# EAGLE design BMI160 SCHEMATIC (EAGLE 9.6.2)
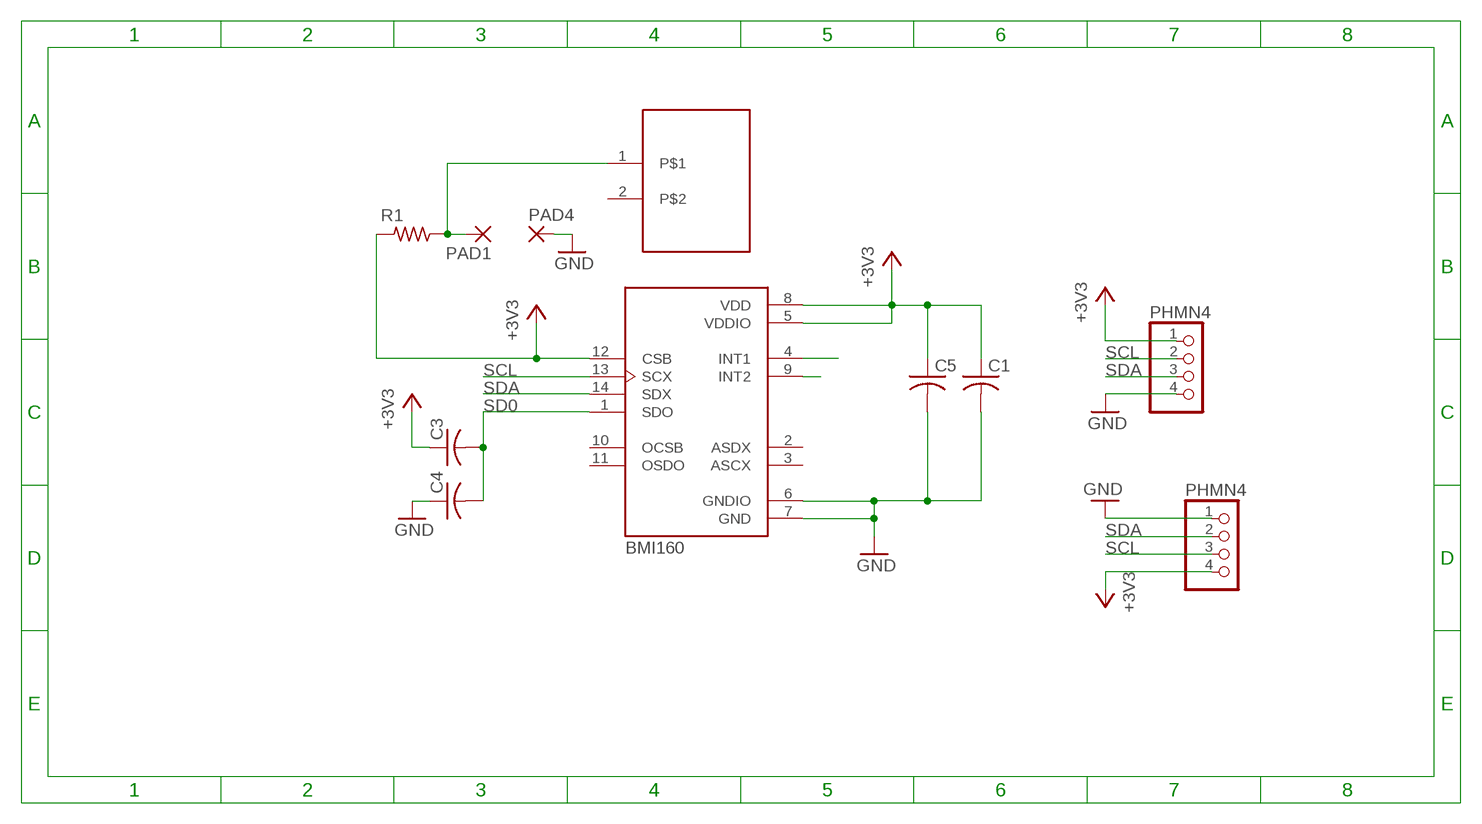
[diagram p0: schematic, sheet 1]

## Parts
C1  C-USC0805  [C0805]
C3  C-USC0805  [C0805]
C4  C-USC0805  [C0805]
C5  C-USC0805  [C0805]
PAD1  WIREPADSMD1,27-254  [SMD1,27-2,54]
PAD4  WIREPADSMD1,27-254  [SMD1,27-2,54]
R1  CRCW08050000Z0EA  [RES_0805]
U1  BMI160  [PQFN50P300X250X88-14N]
U$1  PHMN4  [1X04]
U$2  PHMN4  [1X04]
U$3  PHMN4-21X02  [HDRV2W64P254_1X2_1016X508X838B]

## Nets
+3.3: C1.1 C3.1 C5.1 R1.2 U1.5(VDDIO) U1.8(VDD) U1.12(CSB) U$1.1 U$2.4 ; supply symbol labelled +3V3
GND: C1.2 C4.1 C5.2 PAD4.1(P) U1.6(GNDIO) U1.7(GND) U$1.4 U$2.1
N$1: U1.9(INT2)
N$2: PAD1.1(P) R1.1 U$3.1
N$5: U1.4(INT1)
SCL: U1.13(SCX) U$1.2 U$2.3
SD0: C3.2 C4.2 U1.1(SDO)
SDA: U1.14(SDX) U$1.3 U$2.2
Unconnected: U1.2(ASDX) U1.3(ASCX) U1.10(OCSB) U1.11(OSDO) U$3.2

## Library data of the parts
C1 C3-C5 = rcl:C-US: CAPACITOR, American symbol; SPICEPREFIX: C
PAD1 PAD4 = wirepad:WIREPAD: Wire PAD connect wire on PCB
R1 = Resistor_Capacitor:CRCW08050000Z0EA: RES SMD 0 OHM JUMPER 1/8W 0805 Manufacturer's datasheet <http://www.vishay.com/docs/20035/dcrcwe3.pdf>; CREATED_BY: PCBLayout.com; DIGIKEY_PART_NUMBER: 541-0.0ATR-ND; MANUFACTURER: Vishay Dale; MPN: CRCW08050000Z0EA; PACKAGE: SMD 0805
U1 = BMI160:BMI160: BMI160 2.5 x 3 mm Tiaxial Accelerometer / Gyroscope Inertial Measurement Unit Check prices <https://pricing.snapeda.com/parts/BMI160/Bosch/view-part?ref=eda>; AVAILABILITY: Warning; DESCRIPTION: Accelerometer, Gyroscope, 6 Axis Sensor I²C, SPI Output; MF: Bosch; MP: BMI160; PACKAGE: LGA-14 Bosch; PRICE: None; PURCHASE-URL: https://pricing.snapeda.com/search/part/BMI160/?ref=eda
U$1 U$2 = USER:PHMN4
U$3 = USER:PHMN4-2

## Net classes
0 default: clearance 0.205 mm

## Board
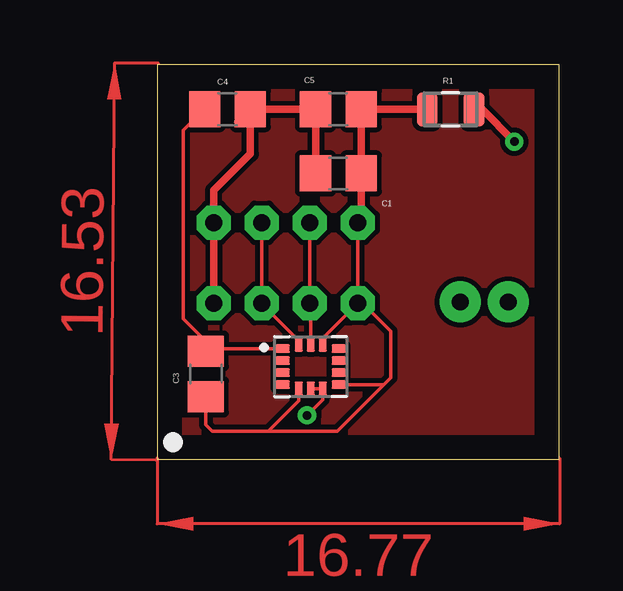
[diagram p1: board, top side]
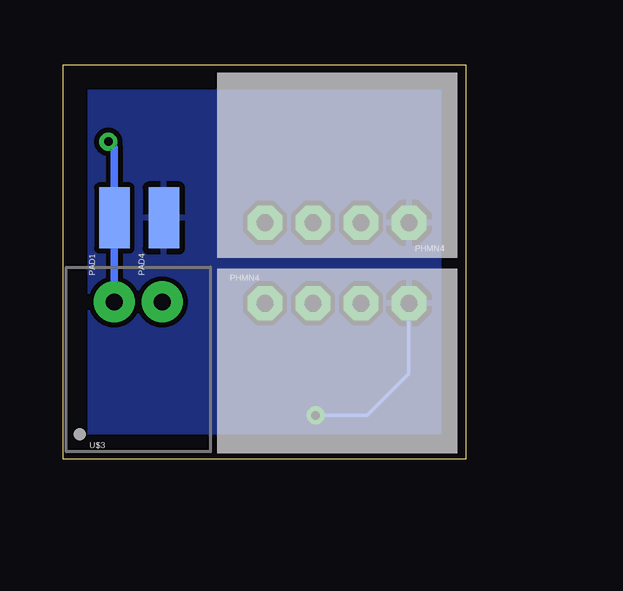
[diagram p2: board, bottom side, seen from below]

Size 16.76 x 16.43 mm. Coordinates in mm from the lower left corner, seen from the top.
Outline: 0,0 16.76,0 16.76,16.43 0,16.43 0,0
Copper layers (1*16): Top 0.035mm / dielectric 1.5mm / Bottom 0.035mm
Design rules "default *": minimum track width 6mil, minimum drill 0.35mm, track to track 6mil, track to pad 6mil, pad to pad 0.2mm, via to via 6mil, smd to smd 6mil, copper to edge 40mil, drill to drill 6mil, minimum pad ring 10mil, minimum via ring 8mil, stop-mask expansion 4mil, vias tented up to drill 0mil, thermal gap 10mil

### Footprints (pad centres in the part's own frame; a part is rotated, then mirrored left to right if it is on the bottom)
C0805 = smd 1.3 x 1.5: 1 -0.95,0; 2 0.95,0
SMD1,27-2,54 = smd 1.27 x 2.54: 1 0,0
RES_0805 = smd 0.87 x 1.42: 1 -0.975,0; 2 0.975,0
PQFN50P300X250X88-14N = smd 0.59 x 0.35: 1 -1.165,0.75; 2 -1.165,0.25; 3 -1.165,-0.25; 4 -1.165,-0.75; 8 1.165,-0.75; 9 1.165,-0.25; 10 1.165,0.25; 11 1.165,0.75 | smd 0.35 x 0.59: 5 -0.5,-0.915; 6 0,-0.915; 7 0.5,-0.915; 12 0.5,0.915; 13 0,0.915; 14 -0.5,0.915
1X04 = drill 0.7 pad 1.422 octagon: 1 -3.08,3.71; 2 -1.08,3.71; 3 0.92,3.71; 4 2.92,3.71
HDRV2W64P254_1X2_1016X508X838B = drill 0.7 pad 1.705: 1 2,6.25; 2 4,6.25

### Placement (x,y rotation side)
C1  7.55,11.91 180 top
C3  2.03,3.56 90 top
C4  2.94,14.59 180 top
C5  7.55,14.59 180 top
PAD1  14.64,10.06 0 bottom
PAD4  12.58,10.06 0 bottom
R1  12.23,14.58 180 top
U1  6.4,3.86 0 top
U$1  5.28,2.78 0 bottom
U$2  5.44,13.56 180 bottom
U$3  16.64,0.3 0 bottom

### Tracks (layer width: path | path; a pad name or v marks a point on that pad's centre or on a via)
+3.3
  Top 0.152: U1.5 5.9,2.44 4.63,1.17 | C3.1 2.03,1.44 2.3,1.17 4.63,1.17 | 4.63,1.17 7.51,1.17 9.45,3.11 9.44,3.11 | U1.8 9.44,3.11 | 9.44,3.11 9.73,3.41 9.73,5.34 8.57,6.49 U$1.1 | U1.12 6.9,5.04 U$1.1 | U$1.1 8.36,9.72 U$2.4 8.5,10 | 8.5,11.74 C1.1
  Top 0.305: 8.73,11.91 C1.1 8.5,9.86 8.36,9.72 | 8.5,11.74 C5.1 R1.2
GND  (via drill 0.35)
  Top 0.152: U1.6 U1.7 6.9,2.48 v6.25,1.83 | C4.1
  Top 0.305: U$1.4 U$2.1 2.36,11.2 3.89,12.73 C4.1 | C4.1 3.37,14.07 | 6.6,11.71 C1.2 C5.2 C4.1
  Bottom 0.152: v6.25,1.83 4.09,1.83 2.36,3.56 U$1.4
  Bottom 0.305: 12.48,9.96 PAD4.1 12.45,9.93 | v6.25,1.83
  pour Bottom: 0,0.05 0,16.58 16.72,16.58 16.77,0.05
N$2  (via drill 0.35)
  Top 0.305: R1.1 13.54,14.58 v14.88,13.23
  Bottom 0.305: v14.88,13.23 14.64,12.99 PAD1.1 14.64,6.79 U$3.1
SCL
  Top 0.152: U1.13 6.4,6.45 U$1.2 U$2.3
SD0
  Top 0.152: U1.1 2.13,4.61 C3.2 2.03,4.92 1.1,5.85 1.1,13.7 C4.2
SDA
  Top 0.152: U1.14 5.9,4.94 U$1.3 U$2.2
TOP
  pour Top: 0.07,16.49 16.93,16.42 17.13,0.04 0,-0.07 -0.07,-0.03
(copper drawn outside any net)
  shapes: Top area x2